# Altium schematic sheet encoder.SchDoc
size A
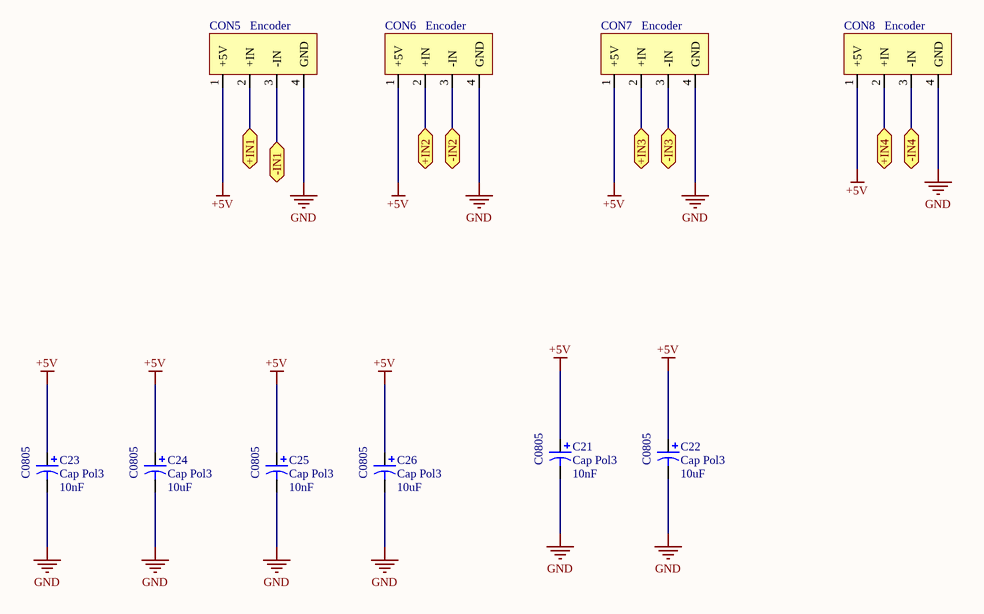
[diagram p0: encoder.SchDoc]

## Parts
C21  Cap Pol3  value 10nF  [C0805]
C22  Cap Pol3  value 10uF  [C0805]
C23  Cap Pol3  value 10nF  [C0805]
C24  Cap Pol3  value 10uF  [C0805]
C25  Cap Pol3  value 10nF  [C0805]
C26  Cap Pol3  value 10uF  [C0805]
CON5  Encoder  [ENCODER]
CON6  Encoder  [ENCODER]
CON7  Encoder  [ENCODER]
CON8  Encoder  [ENCODER]

## Ports
+IN1, +IN2, +IN3, +IN4, -IN1, -IN2, -IN3, -IN4

## Nets
+5V: C21.1 C22.1 C23.1 C24.1 C25.1 C26.1 CON5.1(+5V) CON6.1(+5V) CON7.1(+5V) CON8.1(+5V)
GND: C21.2 C22.2 C23.2 C24.2 C25.2 C26.2 CON5.4(GND) CON6.4(GND) CON7.4(GND) CON8.4(GND)
+IN1: CON5.2(+IN) ; port +IN1
+IN2: CON6.2(+IN) ; port +IN2
+IN3: CON7.2(+IN) ; port +IN3
+IN4: CON8.2(+IN) ; port +IN4
-IN1: CON5.3(-IN) ; port -IN1
-IN2: CON6.3(-IN) ; port -IN2
-IN3: CON7.3(-IN) ; port -IN3
-IN4: CON8.3(-IN) ; port -IN4

## Library data of the parts
C21-C26 = Cap Pol3: Polarized Capacitor (Surface Mount); Published: 8-Jun-2000; LatestRevisionDate: 29-May-2009; LatestRevisionNote: IPC-7351 Footprint Added.; PackageReference: C0805; Publisher: Altium Limited; PackageDescription: Chip Capacitor